# EAGLE schematic Nu_Multi_Output_Board (EAGLE 7.6.0)
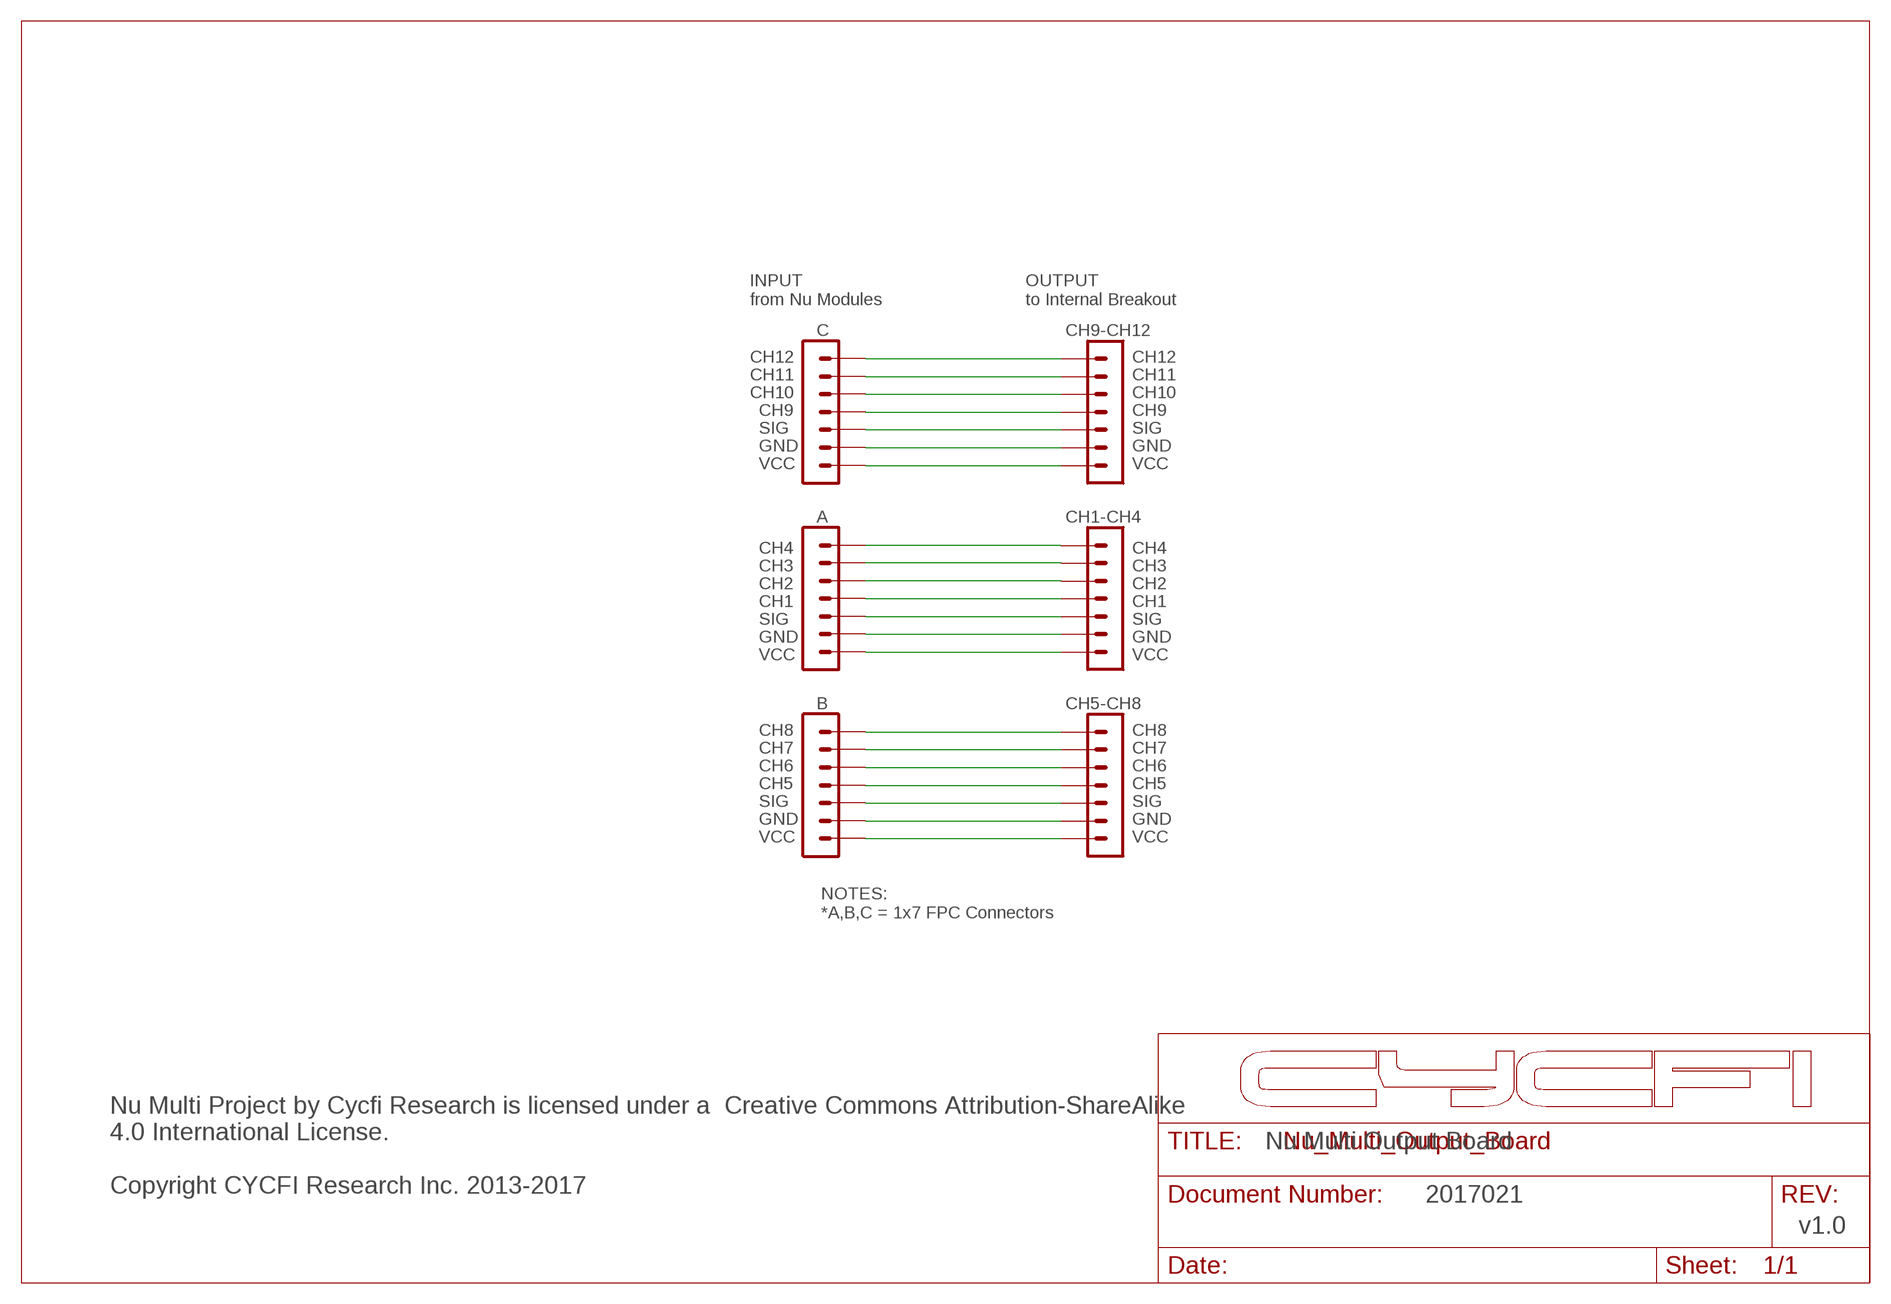
[diagram p0: schematic, sheet 1]

## Parts
H1  7P_ZIF_59453-071110EDHLF  [7P_ZIF_59453-071110EDHLF]
H2  7P_ZIF_59453-071110EDHLF  [7P_ZIF_59453-071110EDHLF]
H3  7P_ZIF_59453-071110EDHLF  [7P_ZIF_59453-071110EDHLF]
H4  7P_ZIF_59453-071110EDHLF  [7P_ZIF_59453-071110EDHLF]
H5  7P_ZIF_59453-071110EDHLF  [7P_ZIF_59453-071110EDHLF]
H6  7P_ZIF_59453-071110EDHLF  [7P_ZIF_59453-071110EDHLF]

## Nets
GND: H1.P$6 H2.P$6 H3.P$6 H4.P$6 H5.P$6 H6.P$6
N$1: H5.P$1 H6.P$1
N$2: H5.P$2 H6.P$2
N$3: H5.P$3 H6.P$3
N$4: H5.P$4 H6.P$4
N$5: H5.P$5 H6.P$5
N$7: H5.P$7 H6.P$7
N$8: H2.P$7 H4.P$7
N$10: H2.P$5 H4.P$5
N$11: H2.P$4 H4.P$4
N$12: H2.P$3 H4.P$3
N$13: H2.P$2 H4.P$2
N$14: H2.P$1 H4.P$1
N$15: H1.P$7 H3.P$7
N$17: H1.P$5 H3.P$5
N$18: H1.P$4 H3.P$4
N$19: H1.P$3 H3.P$3
N$20: H1.P$2 H3.P$2
N$21: H1.P$1 H3.P$1

## Notes on the sheet
- INPUT
  from Nu Modules
- OUTPUT
  to Internal Breakout
- C | CH9-CH12
- CH12 | CH12
- CH11 | CH11
- CH10 | CH10
- CH9 | CH9
- SIG | SIG
- GND | GND
- VCC | VCC
- A | CH1-CH4
- CH4 | CH4
- CH3 | CH3
- CH2 | CH2
- CH1 | CH1
- SIG | SIG
- GND | GND
- VCC | VCC
- B | CH5-CH8
- CH8 | CH8
- CH7 | CH7
- CH6 | CH6
- CH5 | CH5
- SIG | SIG
- GND | GND
- VCC | VCC
- NOTES:
  *A,B,C = 1x7 FPC Connectors
- Nu Multi Output Board
- Nu Multi Project by Cycfi Research is licensed under a  Creative Commons Attribution-ShareAlike
  4.0 International License. 
  
  Copyright CYCFI Research Inc. 2013-2017
- 2017021
- v1.0

## Library data of the parts
H1-H6 = CYCFI_Con:7P_ZIF_59453-071110EDHLF